# Altium schematic sheet 1_MCU.schdoc
size 429 x 307 mm; Symbol: Drawing-Symbol_A4; Device: Drawing-Symbol_A4; @Project Name: Custom Keyboard; @Page Count: 2; @Update Date: 2025-12-14; @Create Date: 2025-12-12; @Schematic Name: Custom Keyboard; @Page No: 1; @Page Name: MCU; Version: V1.0; Page Size: A3; Drawn: Michael Varga; @Create Time: 15:53:55; @Update Time: 20:37:25; Width: 1655; Height: 1170; Region Start: 1; X Region Count: 6; Y Region Count: 4; Blade Width: 10; Title Block Position: 3; @Board Name: Custom Keyboard
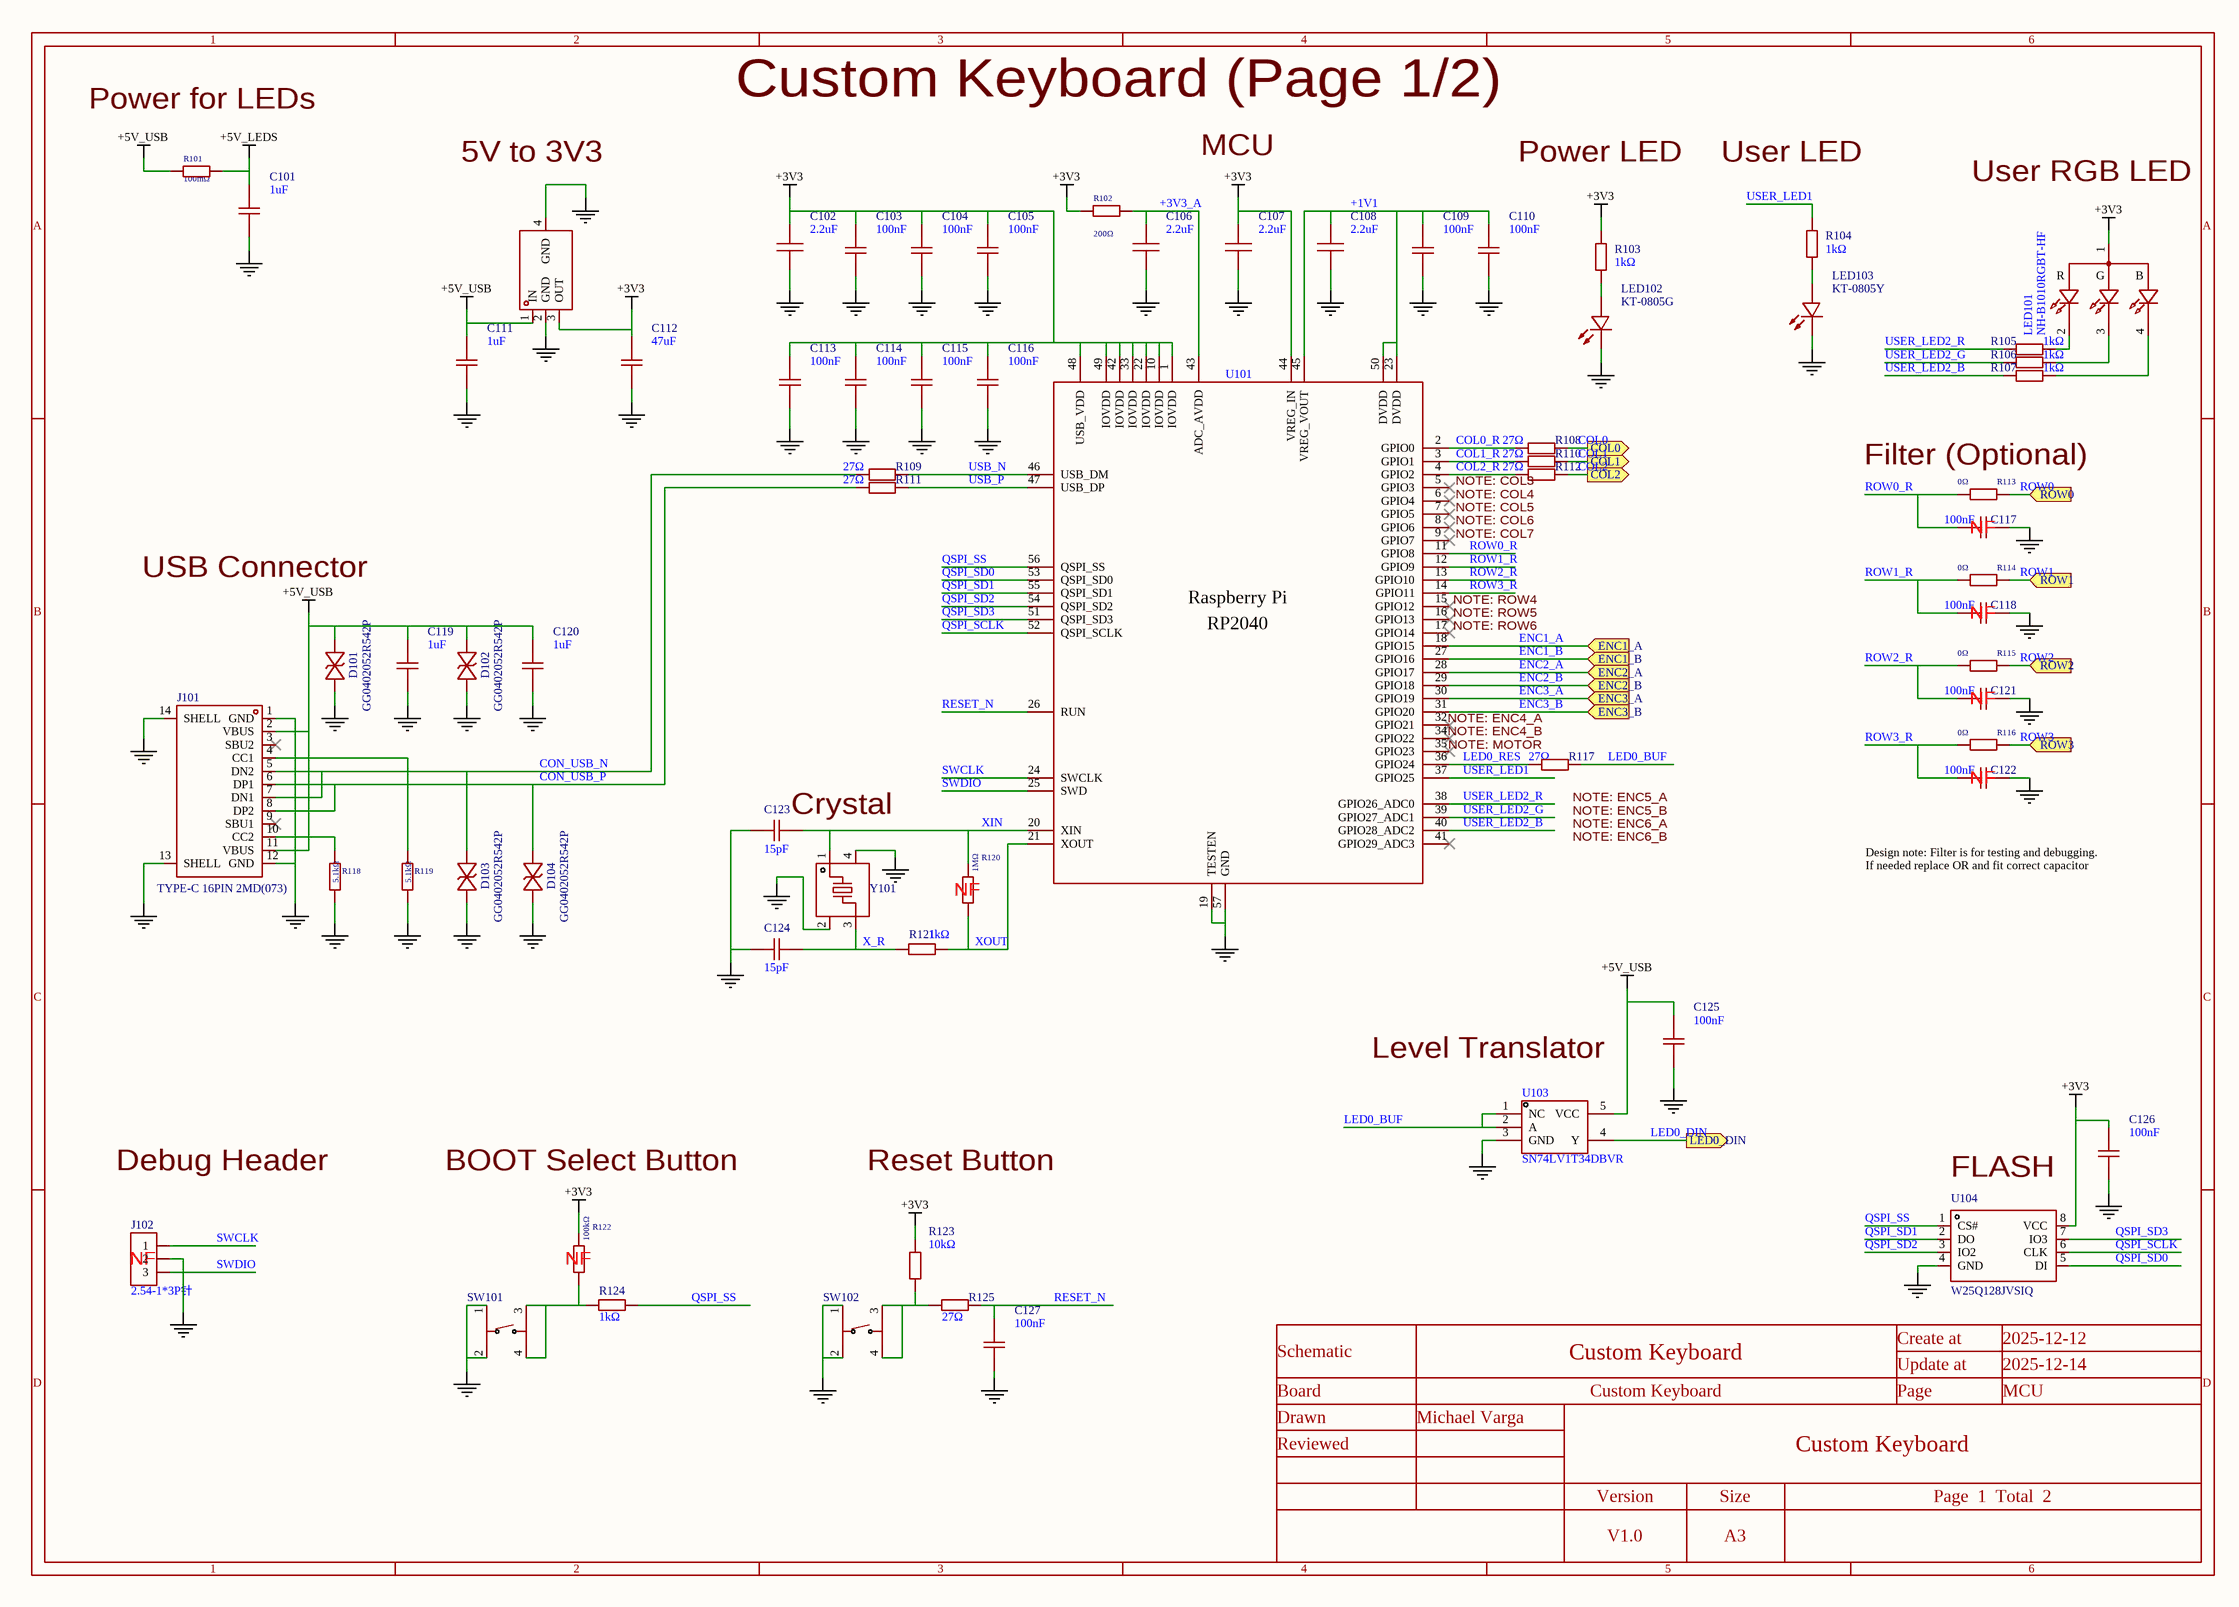
[diagram p0: 1_MCU.schdoc]

## Parts
C101  1uF  [C0402]
C102  2.2uF  [C0402]
C103  100nF  [C0402]
C104  100nF  [C0402]
C105  100nF  [C0402]
C106  2.2uF  [C0402]
C107  2.2uF  [C0402]
C108  2.2uF  [C0402]
C109  100nF  [C0402]
C110  100nF  [C0402]
C111  1uF  [C0402]
C112  47uF  [C1206]
C113  100nF  [C0402]
C114  100nF  [C0402]
C115  100nF  [C0402]
C116  100nF  [C0402]
C117  100nF  [C0402]
C118  100nF  [C0402]
C119  1uF  [C0402]
C120  1uF  [C0402]
C121  100nF  [C0402]
C122  100nF  [C0402]
C123  15pF  [C0402]
C124  15pF  [C0402]
C125  100nF  [C0402]
C126  100nF  [C0402]
C127  100nF  [C0402]
D101  GG0402052R542P  [D0402-BI]
D102  GG0402052R542P  [D0402-BI]
D103  GG0402052R542P  [D0402-BI]
D104  GG0402052R542P  [D0402-BI]
J101  TYPE-C 16PIN 2MD(073)  [USB-C-SMD_TYPE-C-6PIN-2MD-073]
J102  2.54-1*3P针  [HDR-TH_3P-P2.54-V-M-1]
LED101  NH-B1010RGBT-HF  [LED-ARRAY-SMD_4P-L1.0-W1.0-TR_NH-B1010RGBT]
LED102  KT-0805G  [LED0805-R-RD]
LED103  KT-0805Y  [LED0805-R-RD]
R101  100mΩ  [R1206]
R102  200Ω  [R0402]
R103  1kΩ  [R0402]
R104  1kΩ  [R0402]
R105  1kΩ  [R0402]
R106  1kΩ  [R0402]
R107  1kΩ  [R0402]
R108  27Ω  [R0402]
R109  27Ω  [R0402]
R110  27Ω  [R0402]
R111  27Ω  [R0402]
R112  27Ω  [R0402]
R113  0Ω  [R0402]
R114  0Ω  [R0402]
R115  0Ω  [R0402]
R116  0Ω  [R0402]
R117  27Ω  [R0402]
R118  5.1kΩ  [R0402]
R119  5.1kΩ  [R0402]
R120  1MΩ  [R0402]
R121  1kΩ  [R0402]
R122  100kΩ  [R0402]
R123  10kΩ  [R0402]
R124  1kΩ  [R0402]
R125  27Ω  [R0402]
SW101  TS-1187A-B-A-B  [SW-SMD_4P-L5.1-W5.1-P3.70-LS6.5-TL_H1.5]  (value not drawn)
SW102  TS-1187A-B-A-B  [SW-SMD_4P-L5.1-W5.1-P3.70-LS6.5-TL_H1.5]  (value not drawn)
U101  RP2040  [LQFN-56_L7.0-W7.0-P0.4-EP]  (value not drawn)
U102  LM3940IMP-3.3/NOPB  [SOT-223_L6.5-W3.5-P2.30-LS7.0-BR]  (value not drawn)
U103  SN74LV1T34DBVR  [SOT-23-5_L2.9-W1.6-P0.95-LS2.8-BR]
U104  W25Q128JVSIQ  [SOIC-8_L5.3-W5.3-P1.27-LS8.0-BL]
Y101  ABM8-272-T3  [CRYSTAL-SMD_4P-L3.2-W2.5-BL]  (value not drawn)

## Ports
COL0 (out), COL1 (out), COL2 (out), ENC1_A (in), ENC1_B (in), ENC2_A (in), ENC2_B (in), ENC3_A (in), ENC3_B (in), LED0_DIN (out), ROW0 (in), ROW1 (in), ROW2 (in), ROW3 (in)

## Nets
+3V3: C102.2 C103.2 C104.2 C105.2 C107.2 C112.2 C113.2 C114.2 C115.2 C116.2 C126.2 LED101.1(+) R102.1 R103.2 R122.2 R123.2 U101.1(IOVDD) U101.10(IOVDD) U101.22(IOVDD) U101.33(IOVDD) U101.42(IOVDD) U101.44(VREG_IN) U101.48(USB_VDD) U101.49(IOVDD) U102.3(OUT) U104.8(VCC)
+5V_LEDS: C101.2 R101.2
+5V_USB: C111.2 C119.2 C120.2 C125.2 D101.2 D102.2 J101.2(VBUS) J101.11(VBUS) R101.1 U102.1(IN) U103.5(VCC)
GND: C101.1 C102.1 C103.1 C104.1 C105.1 C106.1 C107.1 C108.1 C109.1 C110.1 C111.1 C112.1 C113.1 C114.1 C115.1 C116.1 C117.1 C118.1 C119.1 C120.1 C121.1 C122.1 C123.2 C124.2 C125.1 C126.1 C127.1 D101.1 D102.1 D103.1 D104.1 J101.1(GND) J101.12(GND) J101.13(SHELL) J101.14(SHELL) J102.2 LED102.2(K) LED103.2(-) R118.1 R119.1 SW101.1(A) SW101.2(B) SW102.1(A) SW102.2(B) U101.19(TESTEN) U101.57(GND) U102.2(GND) U102.4(GND) U103.3(GND) U104.4(GND) Y101.2(GND) Y101.4(GND)
+1V1: C108.2 C109.2 C110.2 U101.23(DVDD) U101.45(VREG_VOUT) U101.50(DVDD)
+3V3_A: C106.2 R102.2 U101.43(ADC_AVDD)
COL0: R108.2 ; port COL0
COL0_R: R108.1 U101.2(GPIO0)
COL1: R110.2 ; port COL1
COL1_R: R110.1 U101.3(GPIO1)
COL2: R112.2 ; port COL2
COL2_R: R112.1 U101.4(GPIO2)
CON_USB_N: D103.2 J101.5(DN2) J101.7(DN1) R109.1
CON_USB_P: D104.2 J101.6(DP1) J101.8(DP2) R111.1
ENC1_A: U101.18(GPIO15) ; port ENC1_A
ENC1_B: U101.27(GPIO16) ; port ENC1_B
ENC2_A: U101.28(GPIO17) ; port ENC2_A
ENC2_B: U101.29(GPIO18) ; port ENC2_B
ENC3_A: U101.30(GPIO19) ; port ENC3_A
ENC3_B: U101.31(GPIO20) ; port ENC3_B
LED0_BUF: R117.2 U103.1(NC) U103.2(A)
LED0_DIN: U103.4(Y) ; port LED0_DIN
LED0_RES: R117.1 U101.36(GPIO24)
QSPI_SCLK: U101.52(QSPI_SCLK) U104.6(CLK)
QSPI_SD0: U101.53(QSPI_SD0) U104.5(DI)
QSPI_SD1: U101.55(QSPI_SD1) U104.2(DO)
QSPI_SD2: U101.54(QSPI_SD2) U104.3(IO2)
QSPI_SD3: U101.51(QSPI_SD3) U104.7(IO3)
QSPI_SS: R124.2 U101.56(QSPI_SS) U104.1(CS#)
RESET_N: C127.2 R125.2 U101.26(RUN)
ROW0: R113.2 ; port ROW0
ROW0_R: C117.2 R113.1 U101.11(GPIO8)
ROW1: R114.2 ; port ROW1
ROW1_R: C118.2 R114.1 U101.12(GPIO9)
ROW2: R115.2 ; port ROW2
ROW2_R: C121.2 R115.1 U101.13(GPIO10)
ROW3: R116.2 ; port ROW3
ROW3_R: C122.2 R116.1 U101.14(GPIO11)
SWCLK: J102.1 U101.24(SWCLK)
SWDIO: J102.3 U101.25(SWD)
USB_N: R109.2 U101.46(USB_DM)
USB_P: R111.2 U101.47(USB_DP)
USER_LED1: R104.2 U101.37(GPIO25)
USER_LED2_B: R107.2 U101.40(GPIO28_ADC2)
USER_LED2_G: R106.2 U101.39(GPIO27_ADC1)
USER_LED2_R: R105.2 U101.38(GPIO26_ADC0)
X_R: C124.1 R121.1 Y101.3
XIN: C123.1 R120.2 U101.20(XIN) Y101.1
XOUT: R120.1 R121.2 U101.21(XOUT)
NetJ101_4: J101.4(CC1) R119.2
NetJ101_10: J101.10(CC2) R118.2
NetLED101_2: LED101.2(-) R105.1
NetLED101_3: LED101.3(-) R106.1
NetLED101_4: LED101.4(-) R107.1
NetLED102_1: LED102.1(A) R103.1
NetLED103_1: LED103.1(+) R104.1
NetR122_1: R122.1 R124.1 SW101.3(C) SW101.4(D)
NetR123_1: R123.1 R125.1 SW102.3(C) SW102.4(D)

Not connected (* = marked no-connect by the designer): J101 3(SBU2)* 9(SBU1)*; U101 5(GPIO3)* 6(GPIO4)* 7(GPIO5)* 8(GPIO6)* 9(GPIO7)* 15(GPIO12)* 16(GPIO13)* 17(GPIO14)* 32(GPIO21)* 34(GPIO22)* 35(GPIO23)* 41(GPIO29_ADC3)*

## Notes on the sheet
- Power for LEDs
- Custom Keyboard (Page 1/2)
- 5V to 3V3
- MCU
- Power LED
- User LED
- User RGB LED
- (near R112) NOTE: COL3
- (near R112) NOTE: COL4
- NOTE: COL5
- (near R113) Filter (Optional)
- USB Connector
- NOTE: COL6
- NOTE: COL7
- (near C117) NF
- (near U101) NOTE: ROW4
- (near U101) NOTE: ROW5
- (near U101) NOTE: ROW6
- (near C118) NF
- (near C121) NF
- NOTE: ENC4_A
- NOTE: ENC4_B
- (near R117) NOTE: MOTOR
- (near C123) Crystal
- (near R117) NOTE: ENC5_A
- (near R117) NOTE: ENC5_B
- NOTE: ENC6_A
- NOTE: ENC6_B
- Design note: Filter is for testing and debugging.
  If needed replace OR and fit correct capacitor
- (near C122) NF
- (near R120) NF
- Level Translator
- Debug Header
- BOOT Select Button
- Reset Button
- (near U104) FLASH
- (near J102) NF
- (near R122) NF
- 1
- 2
- 3
- 4
- 5
- 6
- A
- B
- C
- Schematic
- Custom Keyboard
- Create at
- Update at
- 2025-12-12
- 2025-12-14
- D
- Board
- Drawn
- Michael Varga
- Page
- Reviewed
- Version
- Size
- Page  1  Total  2
- V1.0
- A3
- (in symbol NH-B1010RGBT-HF_RF_v1.0) R; G; B
- (in symbol RP2040_C2040_RF_v1.0) Raspberry Pi

## Library data of the parts
C101 C111 C119 C120 = CL05A105KA5NQNC: Manufacturer: SAMSUNG(三星); Add into BOM: yes; Tolerance: ±10%; Voltage Rating: 25V; Temperature Coefficient: X5R; Symbol: CL05A105KA5NQNC; Device: CL05A105KA5NQNC; LCSC Part Name: 1uF ±10% 25V; Supplier Part: C52923; Manufacturer Part: CL05A105KA5NQNC; Supplier Footprint: 0402; JLCPCB Part Class: Basic Part; Datasheet: https://item.szlcsc.com/datasheet/CL05A105KA5NQNC/53938.html; Supplier: LCSC; Convert to PCB: yes; Value: 1uF
C102 C106-C108 = CL05A225MQ5NSNC: Manufacturer: SAMSUNG(三星); Add into BOM: yes; Tolerance: ±20%; Voltage Rating: 6.3V; Temperature Coefficient: X5R; Symbol: CL05A225MQ5NSNC; Device: CL05A225MQ5NSNC; LCSC Part Name: 2.2uF ±20% 6.3V; Supplier Part: C12530; Manufacturer Part: CL05A225MQ5NSNC; Supplier Footprint: 0402; JLCPCB Part Class: Basic Part; Datasheet: https://item.szlcsc.com/datasheet/CL05A225MQ5NSNC/13164.html; Supplier: LCSC; Convert to PCB: yes; Value: 2.2uF
C103-C105 C109 C110 C113-C116 C125-C127 = CL05B104KO5NNNC: Manufacturer: SAMSUNG(三星); Add into BOM: yes; Tolerance: ±10%; Voltage Rating: 16V; Temperature Coefficient: X7R; Symbol: CL05B104KO5NNNC; Device: CL05B104KO5NNNC; LCSC Part Name: 100nF ±10% 16V; Supplier Part: C1525; Manufacturer Part: CL05B104KO5NNNC; Supplier Footprint: 0402; JLCPCB Part Class: Basic Part; Datasheet: https://item.szlcsc.com/datasheet/CL05B104KO5NNNC/1877.html; Supplier: LCSC; Convert to PCB: yes; Value: 100nF
C112 = CL31A476MPHNNNE: Manufacturer: SAMSUNG(三星); Add into BOM: yes; Tolerance: ±20%; Voltage Rating: 10V; Temperature Coefficient: X5R; Symbol: CL31A476MPHNNNE; Device: CL31A476MPHNNNE; LCSC Part Name: 47uF ±20% 10V; Supplier Part: C96123; Manufacturer Part: CL31A476MPHNNNE; Supplier Footprint: 1206; JLCPCB Part Class: Basic Part; Datasheet: https://item.szlcsc.com/datasheet/CL31A476MPHNNNE/97327.html; Supplier: LCSC; Convert to PCB: yes; Value: 47uF
C117 C118 C121 C122 = CL05B104KO5NNNC: Manufacturer: SAMSUNG(三星); Add into BOM: no; Convert to PCB: yes; Tolerance: ±10%; Voltage Rating: 16V; Temperature Coefficient: X7R; Symbol: CL05B104KO5NNNC; Device: CL05B104KO5NNNC; LCSC Part Name: 100nF ±10% 16V; Supplier Part: C1525; Manufacturer Part: CL05B104KO5NNNC; Supplier Footprint: 0402; JLCPCB Part Class: Basic Part; Datasheet: https://item.szlcsc.com/datasheet/CL05B104KO5NNNC/1877.html; Supplier: LCSC; Value: 100nF
C123 C124 = CL05C150JB5NNNC: Manufacturer: SAMSUNG(三星); Add into BOM: yes; Tolerance: ±5%; Voltage Rating: 50V; Temperature Coefficient: C0G; Symbol: CL05C150JB5NNNC; Device: CL05C150JB5NNNC; LCSC Part Name: 15pF ±5% 50V; Supplier Part: C86285; Manufacturer Part: CL05C150JB5NNNC; Supplier Footprint: 0402; JLCPCB Part Class: Extended Part; Datasheet: https://item.szlcsc.com/datasheet/CL05C150JB5NNNC/87461.html; Supplier: LCSC; Convert to PCB: yes; Value: 15pF
D101-D104 = GG0402052R542P: Manufacturer: Kyocera AVX; Add into BOM: yes; Reverse Stand-Off Voltage (Vrwm): 5V; Clamping Voltage: 15.5V; Peak Pulse Current (Ipp): 3A@8/20us; Peak Pulse Power Dissipation (Ppp): 46W@8/20us; Voltage - Breakdown: 5.5V; Reverse Leakage Current (Ir): 100nA; level of protection: IEC 61000-4-4；IEC 61000-4-2; Type: ESD; Junction Capacitance: 2.5pF; Symbol: GG0402052R542P; Device: GG0402052R542P; LCSC Part Name: ESD 5V截止 峰值脉冲电流：3A@8/20us; Supplier Part: C1973257; Manufacturer Part: GG0402052R542P; Supplier Footprint: 0402; JLCPCB Part Class: Extended Part; Supplier: LCSC; Convert to PCB: yes; Operating Temperature: -55℃~+125℃
J101 = TYPE-C 16PIN 2MD(073): Manufacturer: SHOU HAN(首韩); Add into BOM: yes; Gender: Female; Number of Contacts: 16P; Number of Ports: 1; Current Rating-Power: 3A; Voltage Rating: 5V; Connect-Disconnect Life: 5,000 Cycles; Detection color: Black; Symbol: TYPE-C 16PIN 2MD(073); Device: TYPE-C 16PIN 2MD(073); LCSC Part Name: Type-C 母 卧贴; Supplier Part: C2765186; Manufacturer Part: TYPE-C 16PIN 2MD(073); Supplier Footprint: SMD; JLCPCB Part Class: Extended Part; Datasheet: https://item.szlcsc.com/datasheet/TYPE-C%252016PIN%25202MD(073)/2901843.html; Supplier: LCSC; Convert to PCB: yes; Connector Type: Type-C; Protocol Standard: -; Mounting Type: Surface Mount, Right Angle; Supplementary Features: -; Center Height: -; Length: -; Operating Temperature: -25℃~+85℃
J102 = 2.54-1*3P针: Manufacturer: BOOMELE(博穆精密); Symbol: Header-Male-2.54_1x3; Add into BOM: no; Convert to PCB: yes; Pin Structure: 1x3P; Pitch: 2.54mm; Circluar Pins/Square Pins: Pin Header; Current Rating: 3A; Device: 2.54-1*3P针; LCSC Part Name: 1x3P 间距:2.54mm 方针 直插; Supplier Part: C49257; Manufacturer Part: 2.54-1*3P针; Supplier Footprint: 插件,P=2.54mm; JLCPCB Part Class: Extended Part; Datasheet: https://item.szlcsc.com/datasheet/2.54-1*3P%25E9%2592%2588/50265.html; Supplier: LCSC; Row Spacing: -; Mounting Type: Through Hole; Number of Rows: 1; Number of Pins: 3P; Voltage Rating (Max): -; Length of Mating Pin: 6mm; Insulation Height: 2.5mm; Length of End Connection Pin: 3mm; Contact Material: Brass; Contact Plating: Gold; Operating Temperature: -40℃~+105℃; Color: Black
LED101 = NH-B1010RGBT-HF_RF_v1.0: Manufacturer: 国星光电; Add into BOM: yes; Diode Configuration: Common Anode; Wavelength - Dominant: R:620nm；G:530nm；B:470nm; Luminous Intensity: R:18mcd；G:25mcd；B:4.5mcd; Viewing Angle: 120°; Forward Current: B:2mA；G:2mA；R:5mA; Forward Voltage(Vf): R:2V；G:2.6V；B:2.7V; Installation Method: op View Mount; Symbol: NH-B1010RGBT-HF_RF_v1.0; Device: NH-B1010RGBT-HF_RF_v1.0; LCSC Part Name: 贴片全彩LED; Supplier Part: C2874113; Manufacturer Part: NH-B1010RGBT-HF; Supplier Footprint: SMD-4P,1x1mm; Datasheet: https://item.szlcsc.com/datasheet/NH-B1010RGBT-HF/3078825.html; Supplier: LCSC; Convert to PCB: yes; Operating Temperature: -30℃~+85℃
LED102 = KT-0805G: Manufacturer: KENTO; Symbol: 0805G (Green); Add into BOM: yes; Illumination Color: Emerald Green; Voltage - Forward(Vf): 2.6V~3.1V; Power(Watts): 100mW; Forward Current: 5mA; Wavelength - Dominant: 513nm~528nm; Peak Wavelength: 525nm; Luminous Intensity: 430mcd; Viewing Angle: 120°; Device: KT-0805G; LCSC Part Name: 0805 翠绿 高亮; Supplier Part: C2297; Manufacturer Part: KT-0805G; Supplier Footprint: 0805; JLCPCB Part Class: Basic Part; Datasheet: https://item.szlcsc.com/datasheet/KT-0805G/2670.html; Supplier: LCSC; Convert to PCB: yes; Lamp Holder Type: -; Diode Configuration: -; Lens Color: -; Color Temperature: -; Mounting Style: -; Operating Temperature: -40℃~+85℃
LED103 = KT-0805Y: Manufacturer: KENTO; Symbol: 17-21SUYC/TR8; Add into BOM: yes; Illumination Color: Yellow; Voltage - Forward(Vf): 1.8V~2.4V; Power(Watts): 40mW; Wavelength - Dominant: 584nm~594nm; Peak Wavelength: 596nm; Lens Color: Water Clear; Luminous Intensity: 175mcd; Viewing Angle: 120°; Device: KT-0805Y; LCSC Part Name: 0805 黄灯 高亮; Supplier Part: C2296; Manufacturer Part: KT-0805Y; Supplier Footprint: 0805; JLCPCB Part Class: Basic Part; Datasheet: https://item.szlcsc.com/datasheet/KT-0805Y/2669.html; Supplier: LCSC; Convert to PCB: yes; Forward Current: -; Diode Configuration: -; Color Temperature: -; Mounting Style: -; Operating Temperature: -40℃~+85℃
R101 = 1206W4F100LT5E: Manufacturer: UNI-ROYAL(厚声); Add into BOM: yes; Tolerance: ±1%; Power(Watts): 250mW; Voltage-Supply(Max): 200V; Temperature Coefficient: ±800ppm/℃; Symbol: 1206W4F100LT5E; Device: 1206W4F100LT5E; Supplier: LCSC; Manufacturer Part: 1206W4F100LT5E; Supplier Part: C25334; Value: 100mΩ; JLCPCB Part Class: Basic Part; LCSC Part Name: 100mΩ ±1% 250mW 厚膜电阻; Supplier Footprint: 1206; Datasheet: https://item.szlcsc.com/datasheet/1206W4F100LT5E/26077.html; Convert to PCB: yes; Type: Thick Film Resistor; Operating Temperature: -55℃~+155℃
R102 = 0402WGF2000TCE: Manufacturer: UNI-ROYAL(厚声); Add into BOM: yes; Tolerance: ±1%; Power(Watts): 62.5mW; Voltage-Supply(Max): 50V; Temperature Coefficient: ±100ppm/℃; Symbol: 0402WGF2000TCE; Device: 0402WGF2000TCE; Supplier: LCSC; Manufacturer Part: 0402WGF2000TCE; Supplier Part: C25087; Value: 200Ω; JLCPCB Part Class: Basic Part; LCSC Part Name: 200Ω ±1% 62.5mW 厚膜电阻; Supplier Footprint: 0402; Datasheet: https://item.szlcsc.com/datasheet/0402WGF2000TCE/25830.html; Convert to PCB: yes; Type: Thick Film Resistor; Operating Temperature: -55℃~+155℃
R103-R107 R121 R124 = 0402WGF1001TCE: Manufacturer: UNI-ROYAL(厚声); Add into BOM: yes; Tolerance: ±1%; Power(Watts): 62.5mW; Voltage-Supply(Max): 50V; Temperature Coefficient: ±100ppm/℃; Symbol: 0402WGF1001TCE; Device: 0402WGF1001TCE; LCSC Part Name: 1kΩ ±1% 62.5mW 厚膜电阻; Supplier Part: C11702; Manufacturer Part: 0402WGF1001TCE; Supplier Footprint: 0402; JLCPCB Part Class: Basic Part; Datasheet: https://item.szlcsc.com/datasheet/0402WGF1001TCE/12256.html; Supplier: LCSC; Convert to PCB: yes; Type: Thick Film Resistor; Value: 1kΩ; Operating Temperature: -55℃~+155℃
R108-R112 R117 R125 = 0402WGF270JTCE: Manufacturer: UNI-ROYAL(厚声); Add into BOM: yes; Tolerance: ±1%; Power(Watts): 62.5mW; Voltage-Supply(Max): 50V; Temperature Coefficient: ±100ppm/℃; Symbol: 0402WGF270JTCE; Device: 0402WGF270JTCE; LCSC Part Name: 27Ω ±1% 62.5mW 厚膜电阻; Supplier Part: C25100; Manufacturer Part: 0402WGF270JTCE; Supplier Footprint: 0402; JLCPCB Part Class: Extended Part; Datasheet: https://item.szlcsc.com/datasheet/0402WGF270JTCE/25843.html; Supplier: LCSC; Convert to PCB: yes; Type: Thick Film Resistor; Value: 27Ω; Operating Temperature: -55℃~+155℃
R113-R116 = 0402WGF0000TCE: Manufacturer: UNI-ROYAL(厚声); Add into BOM: yes; Tolerance: ±1%; Power(Watts): 62.5mW; Voltage-Supply(Max): 50V; Temperature Coefficient: ±800ppm/℃; Symbol: 0402WGF0000TCE; Device: 0402WGF0000TCE; Supplier: LCSC; Manufacturer Part: 0402WGF0000TCE; Supplier Part: C17168; Value: 0Ω; JLCPCB Part Class: Basic Part; LCSC Part Name: 0Ω ±1% 62.5mW 厚膜电阻; Supplier Footprint: 0402; Datasheet: https://item.szlcsc.com/datasheet/0402WGF0000TCE/17853.html; Convert to PCB: yes; Type: Thick Film Resistor; Operating Temperature: -55℃~+155℃
R118 R119 = 0402WGF5101TCE: Manufacturer: UNI-ROYAL(厚声); Add into BOM: yes; Tolerance: ±1%; Power(Watts): 62.5mW; Voltage-Supply(Max): 50V; Temperature Coefficient: ±100ppm/℃; Symbol: 0402WGF5101TCE; Device: 0402WGF5101TCE; Supplier: LCSC; Manufacturer Part: 0402WGF5101TCE; Supplier Part: C25905; Value: 5.1kΩ; JLCPCB Part Class: Basic Part; LCSC Part Name: 5.1kΩ ±1% 62.5mW 厚膜电阻; Supplier Footprint: 0402; Datasheet: https://item.szlcsc.com/datasheet/0402WGF5101TCE/26648.html; Convert to PCB: yes; Type: Thick Film Resistor; Operating Temperature: -55℃~+155℃
R120 = 0402WGF1004TCE: Manufacturer: UNI-ROYAL(厚声); Add into BOM: no; Convert to PCB: yes; Tolerance: ±1%; Power(Watts): 62.5mW; Voltage-Supply(Max): 50V; Temperature Coefficient: ±100ppm/℃; Symbol: 0402WGF1004TCE; Device: 0402WGF1004TCE; Supplier: LCSC; Manufacturer Part: 0402WGF1004TCE; Supplier Part: C26083; Value: 1MΩ; JLCPCB Part Class: Basic Part; LCSC Part Name: 1MΩ ±1% 62.5mW 厚膜电阻; Supplier Footprint: 0402; Datasheet: https://item.szlcsc.com/datasheet/0402WGF1004TCE/26826.html; Type: Thick Film Resistor; Operating Temperature: -55℃~+155℃
R122 = 0402WGF1003TCE: Manufacturer: UNI-ROYAL(厚声); Add into BOM: no; Convert to PCB: yes; Tolerance: ±1%; Power(Watts): 62.5mW; Voltage-Supply(Max): 50V; Temperature Coefficient: ±100ppm/℃; Symbol: 0402WGF1003TCE; Device: 0402WGF1003TCE; Supplier: LCSC; Manufacturer Part: 0402WGF1003TCE; Supplier Part: C25741; Value: 100kΩ; JLCPCB Part Class: Basic Part; LCSC Part Name: 100kΩ ±1% 62.5mW 厚膜电阻; Supplier Footprint: 0402; Datasheet: https://item.szlcsc.com/datasheet/0402WGF1003TCE/26484.html; Type: Thick Film Resistor; Operating Temperature: -55℃~+155℃
R123 = 0402WGF1002TCE: Manufacturer: UNI-ROYAL(厚声); Add into BOM: yes; Tolerance: ±1%; Power(Watts): 62.5mW; Voltage-Supply(Max): 50V; Temperature Coefficient: ±100ppm/℃; Symbol: 0402WGF1002TCE; Device: 0402WGF1002TCE; LCSC Part Name: 10kΩ ±1% 62.5mW 厚膜电阻; Supplier Part: C25744; Manufacturer Part: 0402WGF1002TCE; Supplier Footprint: 0402; JLCPCB Part Class: Basic Part; Datasheet: https://item.szlcsc.com/datasheet/0402WGF1002TCE/26487.html; Supplier: LCSC; Convert to PCB: yes; Type: Thick Film Resistor; Value: 10kΩ; Operating Temperature: -55℃~+155℃
SW101 SW102 = TS-1187A-B-A-B: Manufacturer: XKB Connection(中国星坤); Add into BOM: yes; Circuit: SPST; Actuator Style: Round Button; Operating Force: 1.6N; Switch Height: 1.5mm; with Bracket: Without Bracket; Contact Current: 50mA; Voltage Rating: 12V; Actuator/Cap Color: Gold; With Lamp: No; Life: 100,000 Cycles; Symbol: TS-1187A-B-A-B; Device: TS-1187A-B-A-B; LCSC Part Name: 5.1*5.1*1.5mm 立贴 轻触开关; Supplier Part: C318884; Manufacturer Part: TS-1187A-B-A-B; Supplier Footprint: SMD; JLCPCB Part Class: Basic Part; Datasheet: https://item.szlcsc.com/datasheet/TS-1187A-B-A-B/299976.html; Supplier: LCSC; Convert to PCB: yes; Mounting Type: Surface Mount,Vertical; Length: 5.1mm; Width: 5.1mm; Operating Temperature: -30℃~+85℃
U101 = RP2040_C2040_RF_v1.0: Manufacturer: Raspberry Pi(树莓派); Add into BOM: yes; CPU Maximum Speed: 133MHz; Number of I/O: 30; ADC (Bit): 12bit; Symbol: RP2040_C2040_RF_v1.0; Device: RP2040_C2040_RF_v1.0; LCSC Part Name: RP2040（RP2B2）; Supplier Part: C2040; Manufacturer Part: RP2040; Supplier Footprint: LQFN-56(7x7); Datasheet: https://item.szlcsc.com/datasheet/RP2040/2392.html; Supplier: LCSC; Convert to PCB: yes; CPU Core: -; Applications: -
U102 = LM3940IMP-3.3/NOPB: Manufacturer: TI(德州仪器); Add into BOM: yes; Output Type: Fixed; Voltage - Supply: 5.5V; Output Voltage: 3.3V; Output Current: 1A; Voltage Dropout: 500mV@(1A); standby current: 10mA; Noise: 250uVrms; Output Configuration: Positive; Number of Outputs: 1; Symbol: LM3940IMP-3.3/NOPB; Device: LM3940IMP-3.3/NOPB; LCSC Part Name: 用于 5V 至 3.3V 电压转换的 1A 低压降稳压器; Supplier Part: C140319; Manufacturer Part: LM3940IMP-3.3/NOPB; Supplier Footprint: SOT-223; JLCPCB Part Class: Extended Part; Datasheet: https://www.ti.com/cn/lit/gpn/lm3940; Supplier: LCSC; Convert to PCB: yes; Power Supply Rejection Ratio (PSRR): -; Features: Over Current Protection；Short Circuit Protection；Over Temperature Protection; Operating Temperature: -40℃~+125℃@(Tj)
U103 = SN74LV1T34DBVR_RF_v1.0: Manufacturer: TI(德州仪器); Add into BOM: yes; Voltage - Supply: 1.6V~5.5V; Number of Elements: 1; Channel Type: Unidirectional; Current - Output Low(IOL): 8mA; Logic Family: 74LV; Quiescent Current: 10uA; Propagation Delay: 5.5ns@5.0V,15pF; Symbol: SN74LV1T34DBVR_RF_v1.0; Device: SN74LV1T34DBVR_RF_v1.0; LCSC Part Name: 单电源单缓冲门CMOS逻辑电平转换器; Supplier Part: C100024; Manufacturer Part: SN74LV1T34DBVR; Supplier Footprint: SOT-23-5; Datasheet: https://www.ti.com/cn/lit/gpn/sn74lv1t34; Supplier: LCSC; Convert to PCB: yes; Input type: -; output type: -; Number of Bits per Element: 1; Current - Output High(IOH): 8mA; Operating Temperature: -40℃~+125℃
U104 = W25Q128JVSIQ: Manufacturer: Winbond(华邦); Symbol: W25Q128JVSIQTR; Add into BOM: yes; Interface: SPI; Memory Size: 128Mbit; Clock Frequency: 133MHz; Voltage - Supply: 2.7V~3.6V; Standby Supply Current: 1uA; Program / Erase Cycles: 100,000 Cycles; Page Programming Time (Tpp): 3ms; Block Erase Time(tBE): 120ms@(32KB); Data Retention - TDR (Year): 20 Years; Device: W25Q128JVSIQ; LCSC Part Name: 编带 支持双路/四路SPI接口的3V、128Mbit 串行闪存; Supplier Part: C97521; Manufacturer Part: W25Q128JVSIQ; Supplier Footprint: SOIC-8-208mil; JLCPCB Part Class: Basic Part; Datasheet: https://item.szlcsc.com/datasheet/W25Q128JVSIQ/98729.html; Supplier: LCSC; Convert to PCB: yes; Operating Temperature: -40℃~+85℃
Y101 = ABM8-272-T3_C20625731: Manufacturer: ABRACON; Add into BOM: yes; Symbol: ABM8-272-T3_C20625731; Device: ABM8-272-T3_C20625731; LCSC Part Name: ABM8-272-T3; Supplier Part: C20625731; Manufacturer Part: ABM8-272-T3; Supplier Footprint: SMD3225-4P; JLCPCB Part Class: Extended Part; Datasheet: https://item.szlcsc.com/datasheet/ABM8-272-T3/22032038.html; Supplier: LCSC; Convert to PCB: yes